# EAGLE design LowDroneBoard (EAGLE 7.4.0)
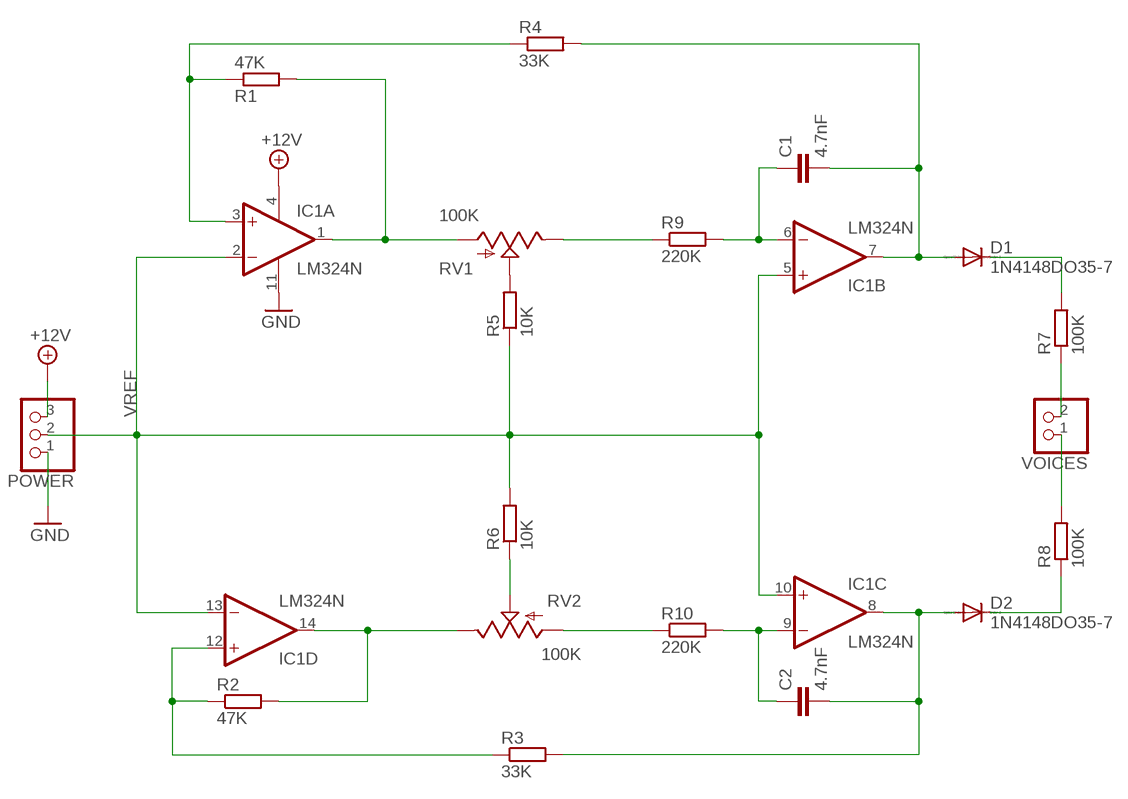
[diagram p0: schematic, sheet 1]

## Parts
C1  4.7nF  CAPPTH  [CAP-PTH-SMALL]
C2  4.7nF  CAPPTH  [CAP-PTH-SMALL]
D1  1N4148DO35-7  [DO35-7]
D2  1N4148DO35-7  [DO35-7]
IC1  LM324N  [DIL14]
POWER  PINHD-1X3/90  [1X03/90]
R1  47K  R-EU_0207/7  [0207/7]
R2  47K  R-EU_0207/7  [0207/7]
R3  33K  R-EU_0207/7  [0207/7]
R4  33K  R-EU_0207/7  [0207/7]
R5  10K  R-EU_0207/7  [0207/7]
R6  10K  R-EU_0207/7  [0207/7]
R7  100K  R-EU_0207/7  [0207/7]
R8  100K  R-EU_0207/7  [0207/7]
R9  220K  R-EU_0207/7  [0207/7]
R10  220K  R-EU_0207/7  [0207/7]
RV1  100K  POT-RV16AF-20  [POT_ALPHA_RV16AF-20]
RV2  100K  POT-RV16AF-20  [POT_ALPHA_RV16AF-20]
VOICES  PINHD-1X2/90  [1X02/90]

## Nets
+12V: IC1.4(P:V+) POWER.3
GND: IC1.11(P:V-) POWER.1
N$1: IC1.12(D:+IN) R2.1 R3.1
N$2: IC1.3(A:+IN) R1.1 R4.1
N$3: IC1.1(A:OUT) R1.2 RV1.1(A)
N$4: IC1.14(D:OUT) R2.2 RV2.3(E)
N$5: C2.1 IC1.9(C:-IN) R10.2
N$6: R5.2 RV1.2(S)
N$7: R6.1 RV2.2(S)
N$8: R8.2 VOICES.1
N$9: R7.1 VOICES.2
N$10: D1.C R7.2
N$11: D2.C R8.1
N$12: C2.2 D2.A IC1.8(C:OUT) R3.2
N$13: C1.2 D1.A IC1.7(B:OUT) R4.2
N$14: R9.1 RV1.3(E)
N$15: C1.1 IC1.6(B:-IN) R9.2
N$22: R10.1 RV2.1(A)
VREF: IC1.2(A:-IN) IC1.5(B:+IN) IC1.10(C:+IN) IC1.13(D:-IN) POWER.2 R5.1 R6.2

## Library data of the parts
C1 C2 = SparkFun-Passives:CAP: Capacitor Standard 0603 ceramic capacitor, and 0.1" leaded capacitor.
D1 D2 = diode:1N4148: DIODE high speed (Philips)
IC1 = linear:LM324: OP AMP
POWER = pinhead:PINHD-1X3: PIN HEADER
R1-R10 = resistor:R-EU_: RESISTOR, European symbol
RV1 RV2 = SparkFun-Electromechanical:POT
VOICES = pinhead:PINHD-1X2: PIN HEADER

## Board
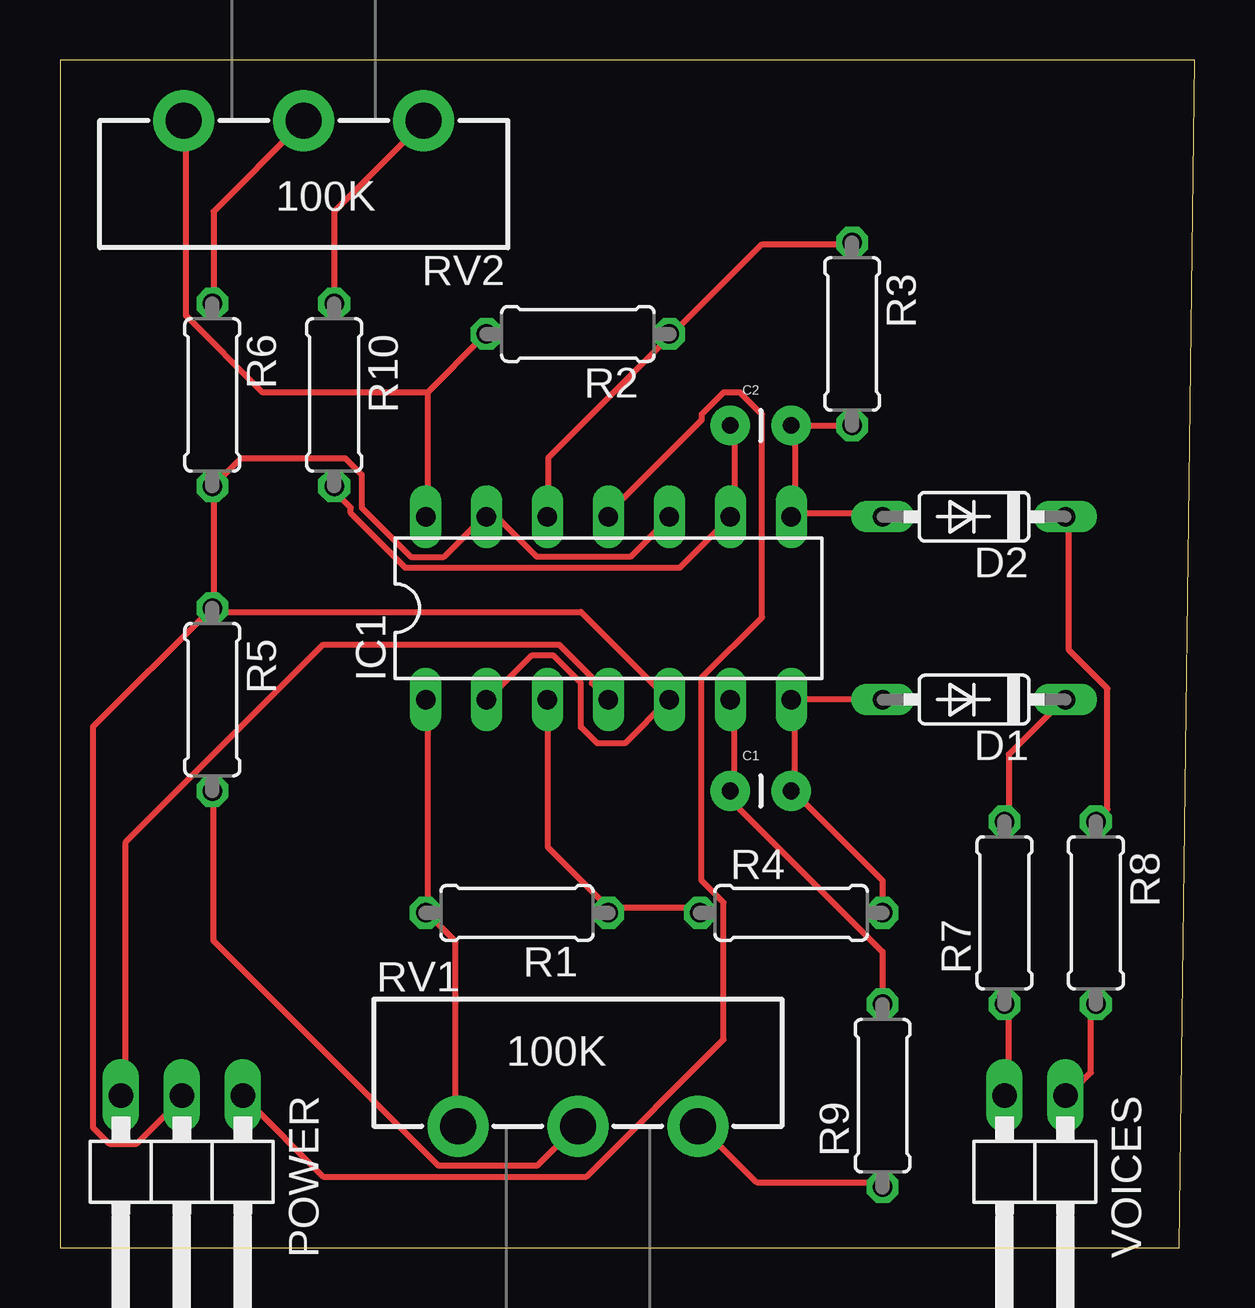
[diagram p1: board, top side]

Size 47.3 x 49.52 mm. Coordinates in mm from the lower left corner, seen from the top.
Outline: 0,0 46.66,0 47.3,49.52 0,49.52 0,0
Copper layers (1*16): Top 0.035mm / dielectric 1.5mm / Bottom 0.035mm
Design rules "default": minimum track width 10mil, minimum drill 24mil, track to track 8mil, track to pad 8mil, pad to pad 8mil, via to via 8mil, smd to smd 8mil, copper to edge 40mil, drill to drill 8mil, minimum pad ring 10mil, minimum via ring 8mil, stop-mask expansion 4mil, vias tented up to drill 0mil, thermal gap 10mil

### Footprints (pad centres in the part's own frame; a part is rotated, then mirrored left to right if it is on the bottom)
CAP-PTH-SMALL = drill 0.7 pad 1.651: 1 0,0; 2 2.54,0
DO35-7 = drill 0.813 long: A 3.81,0; C -3.81,0
DIL14 = drill 0.813 long: 1 -7.62,-3.81; 2 -5.08,-3.81; 3 -2.54,-3.81; 4 0,-3.81; 5 2.54,-3.81; 6 5.08,-3.81; 7 7.62,-3.81; 8 7.62,3.81; 9 5.08,3.81; 10 2.54,3.81; 11 0,3.81; 12 -2.54,3.81; 13 -5.08,3.81; 14 -7.62,3.81
1X03/90 = drill 1.016 long: 1 -2.54,-3.81; 2 0,-3.81; 3 2.54,-3.81
0207/7 = drill 0.813 octagon: 1 -3.81,0; 2 3.81,0
POT_ALPHA_RV16AF-20 = drill 1.5 pad 2.54: 1 -5,0; 2 0,0; 3 5,0
1X02/90 = drill 1.016 long: 1 -1.27,-3.81; 2 1.27,-3.81

### Placement (x,y rotation side)
C1  27.94,19.05 0 top
C2  27.94,34.29 0 top
D1  38.1,22.86 180 top
D2  38.1,30.48 180 top
IC1  22.86,26.67 0 top
POWER  5.08,2.54 180 top
R1  19.05,13.97 180 top
R2  21.59,38.1 180 top
R3  33.02,38.1 270 top
R4  30.48,13.97 0 top
R5  6.35,22.86 270 top
R6  6.35,35.56 270 top
R7  39.37,13.97 90 top
R8  43.18,13.97 270 top
R9  34.29,6.35 90 top
R10  11.43,35.56 270 top
RV1  21.59,5.08 0 top
RV2  10.16,46.99 180 top
VOICES  40.64,2.54 180 top

### Tracks (layer width: path | path; a pad name or v marks a point on that pad's centre or on a via)
+12V
  Top 0.254: IC1.4 22.17,23.55 22.17,23.77 20.8,25.15 10.97,25.15 2.74,16.92 2.74,6.4 POWER.3
GND
  Top 0.254: IC1.11 22.86,30.63 26.75,34.52 26.75,34.75 27.66,35.66 28.35,35.66 29.26,34.75 29.26,26.29 26.75,23.77 26.75,15.32 27.66,14.4 27.66,8.69 21.95,2.97 10.97,2.97 7.77,6.17 POWER.1
N$1
  Top 0.254: IC1.12 20.34,30.63 20.34,32.92 25.38,37.95 R2.1 25.6,38.18 29.26,41.83 32.92,41.83 R3.1
N$2
  Top 0.254: 22.86,14.17 26.52,14.17 R4.1 | 22.86,14.17 20.34,16.69 20.34,22.86 IC1.3 | 22.86,14.17 R1.1
N$3
  Top 0.254: IC1.1 15.32,22.86 15.32,14.17 R1.2 15.32,13.95 16.46,12.8 16.46,5.26 RV1.1
N$4
  Top 0.254: 15.32,35.66 15.32,30.63 IC1.14 | 15.32,35.66 17.6,37.95 R2.2 | 15.32,35.66 8.46,35.66 5.26,38.86 5.26,46.86 RV2.3
N$5
  Top 0.254: C2.1 28.12,34.29 28.12,30.63 IC1.9 27.89,30.4 25.83,28.35 14.4,28.35 12.12,30.63 12.12,30.86 11.43,31.55 R10.2
N$6
  Top 0.254: R5.2 6.4,18.97 6.4,12.8 15.77,3.43 19.89,3.43 21.49,5.03 RV1.2
N$7
  Top 0.254: R6.1 6.4,39.55 6.4,43.2 10.06,46.86 RV2.2
N$8
  Top 0.254: R8.2 42.98,10.06 42.98,7.32 42.06,6.4 VOICES.1
N$9
  Top 0.254: R7.1 39.55,10.06 39.55,6.4 VOICES.2
N$10
  Top 0.254: R7.2 39.55,17.83 39.55,20.57 41.83,22.86 D1.C
N$11
  Top 0.254: D2.C 42.06,30.4 42.06,24.92 43.66,23.32 43.66,18.29 43.2,17.83 R8.1
N$12
  Top 0.254: 30.63,34.29 30.63,30.63 | 30.63,30.63 34.29,30.63 D2.A | 30.63,30.63 IC1.8 | 30.63,34.29 R3.2 | 30.63,34.29 C2.2
N$13
  Top 0.254: D1.A 30.63,22.86 | R4.2 34.29,15.32 30.63,18.97 C1.2 30.63,19.2 30.63,22.86 | 30.63,22.86 IC1.7
N$14
  Top 0.254: R9.1 34.29,2.74 29.03,2.74 26.75,5.03 RV1.3
N$15
  Top 0.254: IC1.6 28.12,22.86 28.12,19.2 C1.1 28.12,18.97 28.12,18.52 34.29,12.34 R9.2
N$22
  Top 0.254: R10.1 11.43,43.2 15.09,46.86 RV2.1
VREF
  Top 0.254: IC1.10 25.38,30.4 23.77,28.8 19.89,28.8 18.29,30.4 17.83,30.4 IC1.13 17.6,30.4 16,28.8 14.63,28.8 12.57,30.86 12.57,32.23 11.89,32.92 7.54,32.92 6.4,31.77 R6.2 6.4,31.55 6.4,26.75 R5.1 | 25.38,22.86 23.55,21.03 22.4,21.03 21.72,21.72 21.72,23.55 20.57,24.69 19.66,24.69 17.83,22.86 IC1.2 | POWER.2 5.03,6.17 3.2,4.34 2.06,4.34 1.37,5.03 1.37,21.72 6.17,26.52 R5.1 | 25.38,22.86 21.72,26.52 6.4,26.52 R5.1 | 25.38,22.86 IC1.5